# EAGLE design digibuttons (EAGLE 9.3.0)
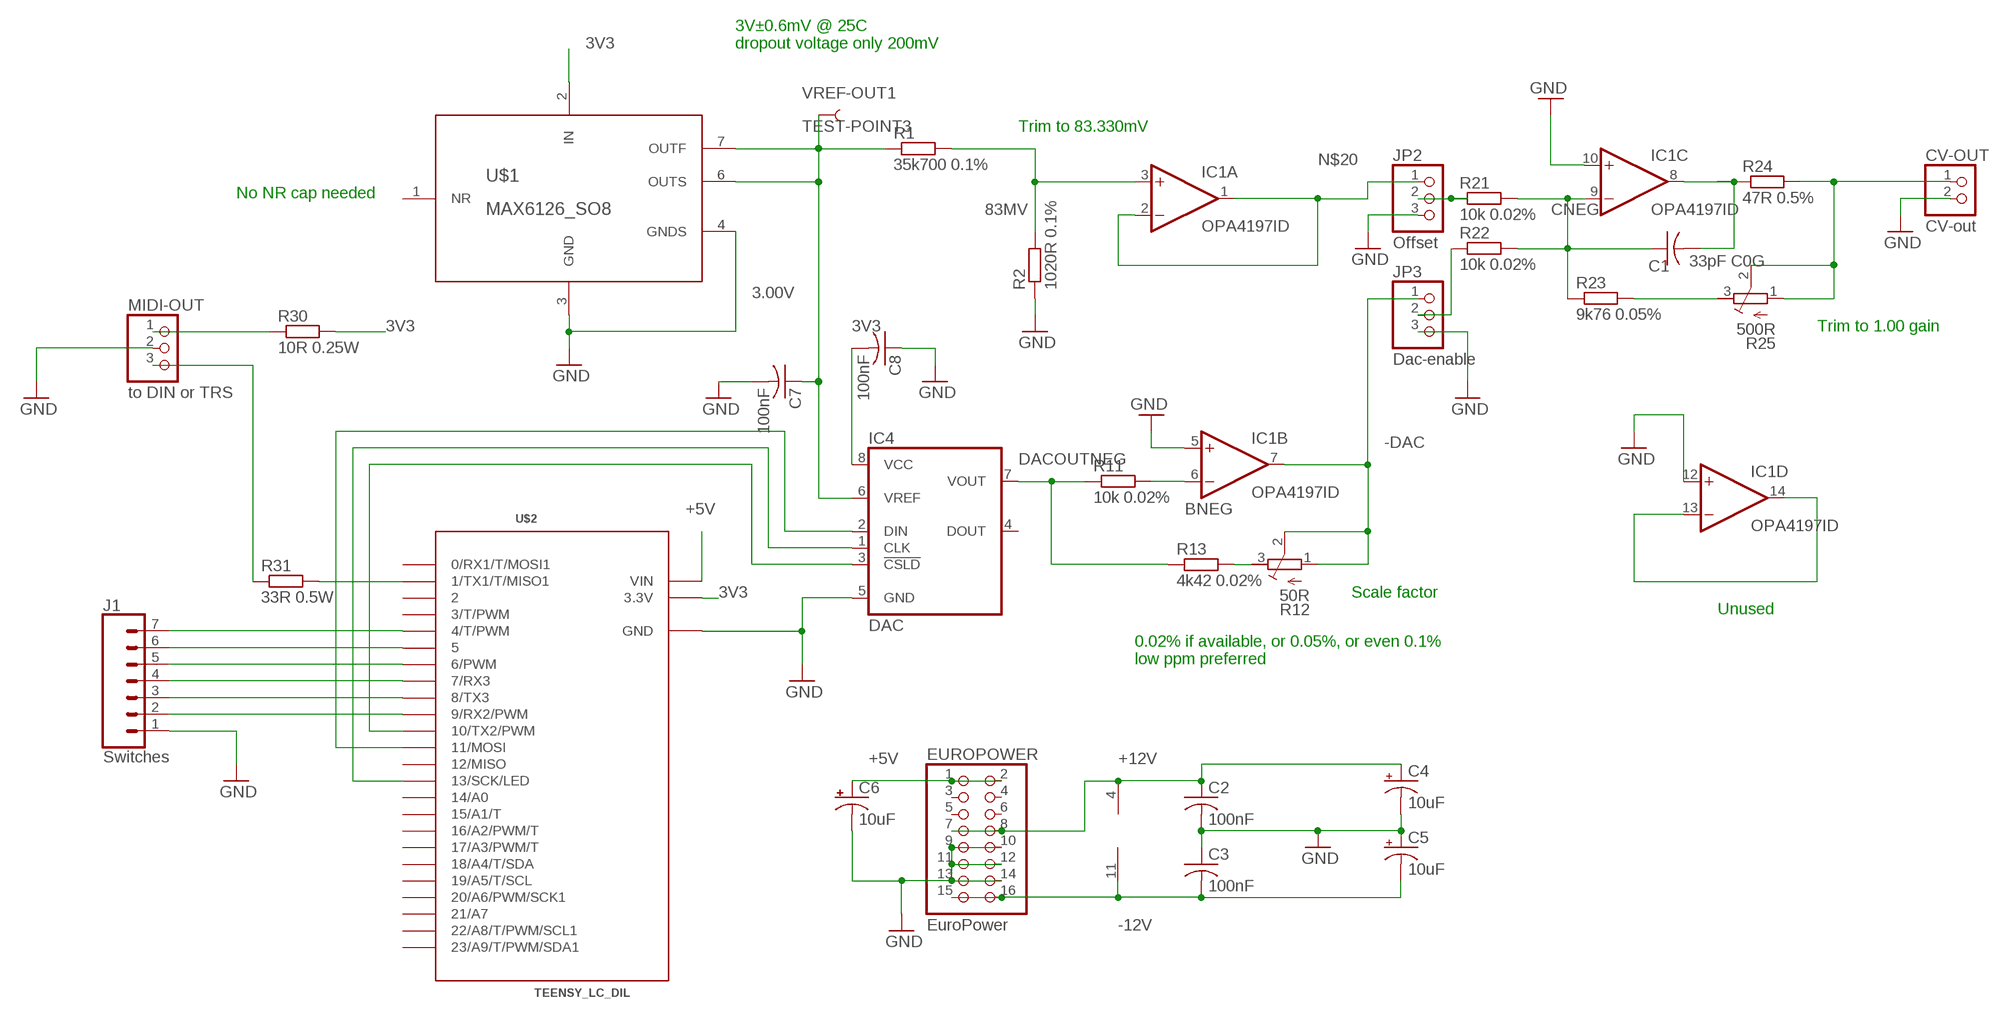
[diagram p0: schematic, sheet 1]

## Parts
C1  33pF C0G  C-USC0805  [C0805]
C2  100nF  C-USC1206  [C1206]
C3  100nF  C-USC1206  [C1206]
C4  10uF  10UF-POLAR-RADIAL-2.5MM-25V-20%  [CPOL-RADIAL-2.5MM-5MM]
C5  10uF  10UF-POLAR-RADIAL-2.5MM-25V-20%  [CPOL-RADIAL-2.5MM-5MM]
C6  10uF  10UF-POLAR-RADIAL-2.5MM-25V-20%  [CPOL-RADIAL-2.5MM-5MM]
C7  100nF  C-USC1206  [C1206]
C8  100nF  C-USC1206  [C1206]
CV-OUT  CV-out  PINHD-1X2  [1X02]
EUROPOWER  EuroPower  PINHD-2X8  [2X08]
IC1  OPA4197ID  OPA4743UA  [SO14]
IC4  DAC  LTC1658CS8SOIC8  [SOIC8_208MIL]
J1  Switches  CONN_07LOCK  [1X07_LOCK]
JP2  Offset  PINHD-1X3  [1X03]
JP3  Dac-enable  PINHD-1X3  [1X03]
MIDI-OUT  to DIN or TRS  PINHD-1X3  [1X03]
R1  35k700 0.1%  R-EU_R0805  [R0805]
R2  1020R 0.1%  R-EU_R0805  [R0805]
R11  10k 0.02%  R-EU_R0805  [R0805]
R12  50R  R-TRIMM3296W  [RTRIM3296W]
R13  4k42 0.02%  R-EU_R0805  [R0805]
R21  10k 0.02%  R-EU_R0805  [R0805]
R22  10k 0.02%  R-EU_R0805  [R0805]
R23  9k76 0.05%  R-EU_R0805  [R0805]
R24  47R 0.5%  R-EU_R0805  [R0805]
R25  500R  R-TRIMM3296W  [RTRIM3296W]
R30  10R 0.25W  RESISTOR10MM_RESISTOR  [10MM_RESISTOR]
R31  33R 0.5W  RESISTOR10MM_RESISTOR  [10MM_RESISTOR]
U$1  MAX6126_SO8  [SO08]
U$2  TEENSY_LC_DIL  [TEENSY_3.0-3.2&LC_DIL]
VREF-OUT1  TEST-POINT3  [PAD.03X.03]

## Nets
3.00V: C7.1 IC4.6(VREF) R1.1 U$1.6(OUTS) U$1.7(OUTF) VREF-OUT1.P$1
3V3: C8.2 IC4.8(VCC) R30.2 U$1.2(IN) U$2.3.3V
83MV: IC1.3(A:+IN) R1.2 R2.2
+5V: C6.1(+) EUROPOWER.1 EUROPOWER.2 U$2.VIN
+12V: C2.1 C4.1(+) EUROPOWER.7 EUROPOWER.8 IC1.4(P:V+)
-12V: C3.2 C5.2(-) EUROPOWER.15 EUROPOWER.16 IC1.11(P:V-)
-DAC: IC1.7(B:OUT) JP3.1 R12.1(E) R12.2(S)
BNEG: IC1.6(B:-IN) R11.2
CNEG: C1.1 IC1.9(C:-IN) R21.2 R22.2 R23.1
CS: IC4.3(!CSLD) U$2.10(10/TX2/PWM)
DACOUTNEG: IC4.7(VOUT) R11.1 R13.1
GND: C2.2 C3.1 C4.2(-) C5.1(+) C6.2(-) C7.2 C8.1 CV-OUT.2 EUROPOWER.9 EUROPOWER.10 EUROPOWER.11 EUROPOWER.12 EUROPOWER.13 EUROPOWER.14 IC1.5(B:+IN) IC1.10(C:+IN) IC1.12(D:+IN) IC4.5(GND) J1.1 JP2.3 JP3.3 MIDI-OUT.2 R2.1 U$1.3(GND) U$1.4(GNDS) U$2.AGND(GND) U$2.GND
MOSI: IC4.2(DIN) U$2.11(11/MOSI)
N$1: MIDI-OUT.1 R30.1
N$2: R31.2 U$2.1(1/TX1/T/MISO1)
N$3: IC1.13(D:-IN) IC1.14(D:OUT)
N$4: JP3.2 R22.1
N$5: MIDI-OUT.3 R31.1
N$6: JP2.2 R21.1
N$8: R23.2 R25.3(A)
N$9: C1.2 IC1.8(C:OUT) R24.1
N$10: CV-OUT.1 R24.2 R25.1(E) R25.2(S)
N$13: J1.2 U$2.9(9/RX2/PWM)
N$14: R12.3(A) R13.2
N$15: J1.3 U$2.8(8/TX3)
N$16: J1.4 U$2.7(7/RX3)
N$17: J1.5 U$2.6(6/PWM)
N$18: J1.6 U$2.5
N$19: J1.7 U$2.4(4/T/PWM)
N$20: IC1.1(A:OUT) IC1.2(A:-IN) JP2.1
SCLK: IC4.1(CLK) U$2.13(13/SCK/LED)
Unconnected: EUROPOWER.3 EUROPOWER.4 EUROPOWER.5 EUROPOWER.6 IC4.4(DOUT) U$1.1(NR) U$2.0(0/RX1/T/MOSI1) U$2.2 U$2.3(3/T/PWM) U$2.12(12/MISO) U$2.14/A0 U$2.15/A1(15/A1/T) U$2.16/A2(16/A2/PWM/T) U$2.17/A3(17/A3/PWM/T) U$2.18/A4(18/A4/T/SDA) U$2.19/A5(19/A5/T/SCL) U$2.20/A6(20/A6/PWM/SCK1) U$2.21/A7 U$2.22/A8(22/A8/T/PWM/SCL1) U$2.23/A9(23/A9/T/PWM/SDA1)

## Notes on the sheet
- 3V±0.6mV @ 25C
  dropout voltage only 200mV
- Trim to 83.330mV
- No NR cap needed
- Trim to 1.00 gain
- Scale factor
- Unused
- 0.02% if available, or 0.05%, or even 0.1%
  low ppm preferred

## Library data of the parts
C1-C3 C7 C8 = adafruit:C-US: CAPACITOR, American symbol
C4-C6 = SparkFun-Capacitors:10UF-POLAR: 10.0µF polarized capacitors A capacitor is a passive two-terminal electrical component used to store electrical energy temporarily in an electric field.; PROD_ID: CAP-08440
CV-OUT = pinhead:PINHD-1X2: PIN HEADER
EUROPOWER = pinhead:PINHD-2X8: PIN HEADER
IC1 = linear:OPA4743: 12V, 7MHz, CMOS, Rail-to-Rail I/O Quad OP AMP Source: http://focus.ti.com/lit/ds/sbos201/sbos201.pdf
IC4 = chris-dac-adc:LTC1658CS8: DIGITAL/ANALOG CONVERTER
J1 = SparkFun-Connectors:CONN_07: Multi connection point. Often used as Generic Header-pin footprint for 0.1 inch spaced/style header connections On any of the 0.1 inch spaced packages, you can populate with these: Break Away Headers - Straight <https://www.sparkfun.com/products/116> (PRT-00116) Break Away Male Headers - Right Angle <https://www.sparkfun.com/products/553> (PRT-00553) Female Headers <https://www.sparkfun.com/products/115> (PRT-00115) Break Away Headers - Machine Pin <https://www.sparkfun.com/products/117> (PRT-00117) Break Away Female Headers - Swiss Machine Pin <https://www.sparkfun.com/products/743> (PRT-00743) For SCREWTERMINALS and SPRING TERMINALS visit here: Screw Terimnals on SparkFun.com <https://www.sparkfun.com/search/results?term=Screw+Terminals> (5mm/3.5mm/2.54mm spacing) This device is also useful as a general connection point to wire up your design to another part of your project. Our various solder wires solder well into these plated through hole pads. Hook-Up Wire - Assortment (Stranded, 22 AWG) <https://www.sparkfun.com/products/11375> (PRT-11375) Hook-Up Wire - Assortment (Solid Core, 22 AWG) <https://www.sparkfun.com/products/11367> (PRT-11367) View the entire wire category on our website here <https://www.sparkfun.com/categories/141> Special notes: Molex polarized connector foot print use with SKU : PRT-08231 with associated crimp pins and housings. 1MM SMD Version SKU: PRT-10208 NOTES ON THE VARIANTS LOCK and LOCK_LONGPADS... This footprint was designed to help hold the alignment of a through-hole component (i.e. 6-pin header) while soldering it into place. You may notice that each hole has been shifted either up or down by 0.005 of an inch from it's more standard position (which is a perfectly straight line). This slight alteration caused the pins (the squares in the middle) to touch the edges of the holes. Because they are alternating, it causes a "brace" to hold the component in place. 0.005 has proven to be the perfect amount of "off-center" position when using our standard breakaway headers. Although looks a little odd when you look at the bare footprint, once you have a header in there, the alteration is very hard to notice. Also,if you push a header all the way into place, it is covered up entirely on the bottom side.
JP2 JP3 MIDI-OUT = adafruit:PINHD-1X3: PIN HEADER
R1 R2 R11 R13 R21-R24 = rcl:R-EU_: RESISTOR, European symbol; SPICEPREFIX: R
R12 R25 = resistor:R-TRIMM: Trimm resistor
R30 R31 = MusicThingModular:RESISTOR: Standard resistor, various versions
U$1 = max6126:MAX6126_SO8
U$2 = Teensy_3_and_LC_Series_Boards_v1.4:TEENSY_LC_DIL
VREF-OUT1 = SparkFun-Connectors:TEST-POINT: SparkFun Test Points Bare copper test points for troubleshooting or In-Circuit-Testing. These are used by our Production team for verifying production board runs using pogo-pins on test beds. SparkFun Products: SparkFun LSM9DS1 Breakout <https://www.sparkfun.com/products/13284> SparkFun PSOC <https://www.sparkfun.com/products/13714> SparkFun Load Cell Amplifier <https://www.sparkfun.com/products/13879>

## Board
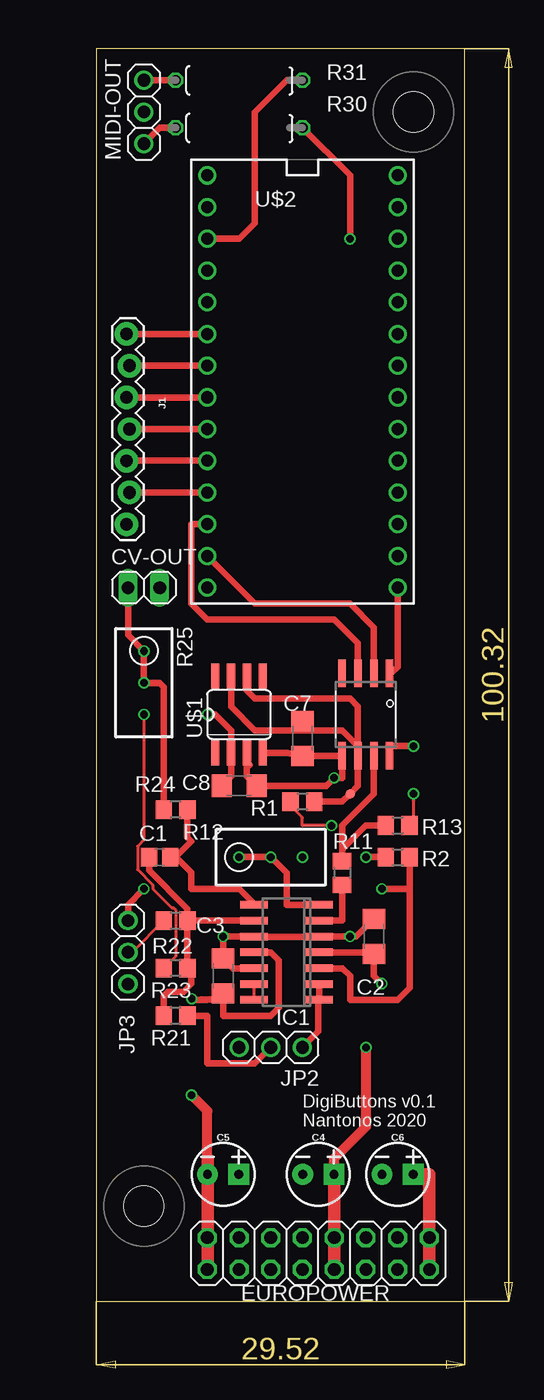
[diagram p1: board, top side]
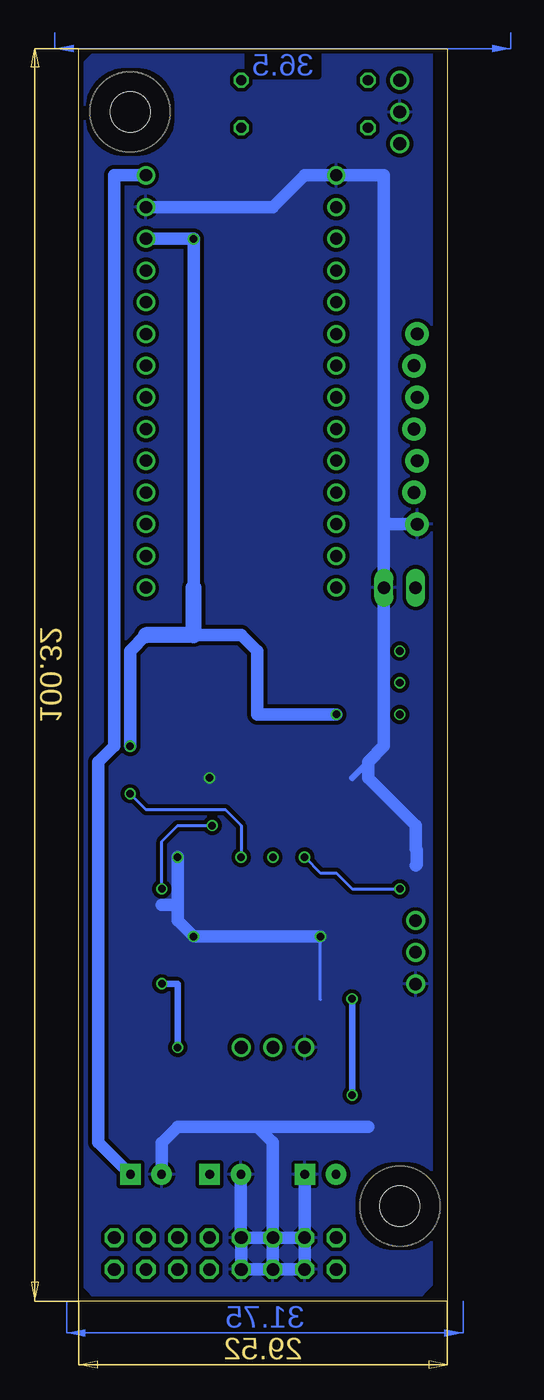
[diagram p2: board, bottom side, seen from below]

Size 29.52 x 100.32 mm. Coordinates in mm from the lower left corner, seen from the top.
Outline: 0,0 29.52,0 29.52,100.32 0,100.32 0,0
Copper layers (1*16): Top 0.035559375mm / dielectric 1.6mm / Bottom 0.035559375mm
Design rules "oshpark-2layer": minimum track width 6mil, minimum drill 10mil, track to track 6mil, track to pad 6mil, pad to pad 6mil, via to via 6mil, smd to smd 6mil, copper to edge 15mil, drill to drill 6mil, minimum pad ring 5mil, minimum via ring 5mil, stop-mask expansion 2.5mil, vias tented up to drill 0mil, thermal gap 10mil

### Footprints (pad centres in the part's own frame; a part is rotated, then mirrored left to right if it is on the bottom)
C0805 = smd 1.3 x 1.5: 1 -0.85,0; 2 0.85,0
C1206 = smd 1.6 x 1.8: 1 -1.4,0; 2 1.4,0
CPOL-RADIAL-2.5MM-5MM = drill 0.7 pad 1.651 square: 1 1.25,0 | drill 0.7 pad 1.651: 2 -1.25,0
1X02 = drill 1.016 long: 1 -1.27,0; 2 1.27,0
2X08 = drill 1.016 octagon: 1 -8.89,-1.27; 2 -8.89,1.27; 3 -6.35,-1.27; 4 -6.35,1.27; 5 -3.81,-1.27; 6 -3.81,1.27; 7 -1.27,-1.27; 8 -1.27,1.27; 9 1.27,-1.27; 10 1.27,1.27; 11 3.81,-1.27; 12 3.81,1.27; 13 6.35,-1.27; 14 6.35,1.27; 15 8.89,-1.27; 16 8.89,1.27
SO14 = smd 0.6 x 2.2: 1 -3.81,-2.6; 2 -2.54,-2.6; 3 -1.27,-2.6; 4 0,-2.6; 5 1.27,-2.6; 6 2.54,-2.6; 7 3.81,-2.6; 8 3.81,2.6; 9 2.54,2.6; 10 1.27,2.6; 11 0,2.6; 12 -1.27,2.6; 13 -2.54,2.6; 14 -3.81,2.6
SOIC8_208MIL = smd 0.6 x 2.2: 1 -1.905,-3.315; 2 -0.635,-3.315; 3 0.635,-3.315; 4 1.905,-3.315; 5 1.905,3.315; 6 0.635,3.315; 7 -0.635,3.315; 8 -1.905,3.315
1X07_LOCK = drill 1.016 pad 1.88: 1 0,0.127; 2 2.54,-0.127; 3 5.08,0.127; 4 7.62,-0.127; 5 10.16,0.127; 6 12.7,-0.127; 7 15.24,0.127
1X03 = drill 1.016: 1 -2.54,0; 2 0,0; 3 2.54,0
R0805 = smd 1.3 x 1.5: 1 -0.95,0; 2 0.95,0
RTRIM3296W = drill 0.61: 1 0,-2.54; 2 0,0; 3 0,2.54
10MM_RESISTOR = drill 0.813 octagon: 1 -5.08,0; 2 5.08,0
SO08 = smd 0.66 x 2.032: 1 -1.905,-3.073; 2 -0.635,-3.073; 3 0.635,-3.073; 4 1.905,-3.073; 5 1.905,3.073; 6 0.635,3.073; 7 -0.635,3.073; 8 -1.905,3.073
TEENSY_3.0-3.2&LC_DIL = drill 0.965: 0 -7.62,13.97; 1 -7.62,11.43; 2 -7.62,8.89; 3 -7.62,6.35; 3.3V 7.62,11.43; 4 -7.62,3.81; 5 -7.62,1.27; 6 -7.62,-1.27; 7 -7.62,-3.81; 8 -7.62,-6.35; 9 -7.62,-8.89; 10 -7.62,-11.43; 11 -7.62,-13.97; 12 -7.62,-16.51; 13 7.62,-16.51; 14/A0 7.62,-13.97; 15/A1 7.62,-11.43; 16/A2 7.62,-8.89; 17/A3 7.62,-6.35; 18/A4 7.62,-3.81; 19/A5 7.62,-1.27; 20/A6 7.62,1.27; 21/A7 7.62,3.81; 22/A8 7.62,6.35; 23/A9 7.62,8.89; AGND 7.62,13.97; GND -7.62,16.51; VIN 7.62,16.51
MOUNTING_HOLE = hole 3.2: 0,0
PAD.03X.03 = smd 0.762 x 0.762: P$1 0,0

### Placement (x,y rotation side)
C1  5.08,35.56 0 top
C2  22.22,29.21 90 top
C3  10.16,26.04 270 top
C4  17.78,10.16 0 top
C5  10.16,10.16 0 top
C6  24.13,10.16 0 top
C7  16.51,45.09 270 top
C8  11.43,41.27 180 top
CV-OUT  3.81,57.15 0 top
EUROPOWER  17.78,3.81 180 top
IC1  15.24,27.94 90 top
IC4  21.59,46.99 180 top
J1  2.54,62.23 90 top
JP2  13.97,20.32 180 top
JP3  2.54,27.94 270 top
MIDI-OUT  3.81,95.25 90 top
R1  16.51,40.01 180 top
R2  24.13,35.56 0 top
R11  19.69,34.29 270 top
R12  13.97,35.56 270 top
R13  24.13,38.1 0 top
R21  6.35,22.86 180 top
R22  6.35,30.48 0 top
R23  6.35,26.67 180 top
R24  6.35,39.37 180 top
R25  3.81,49.53 180 top
R30  11.43,93.98 0 top
R31  11.43,97.79 0 top
U$1  11.43,46.99 0 top
U$2  16.51,73.66 0 top
U$3  MOUNTING_HOLE  [MOUNTING_HOLE]  25.4,95.25 0 top
U$4  MOUNTING_HOLE  [MOUNTING_HOLE]  3.81,7.62 0 top
VREF-OUT1  20.32,40.64 0 top

### Tracks (layer width: path | path; a pad name or v marks a point on that pad's centre or on a via)
3.00V
  Top 0.254: C7.1 16.51,45.72
  Top 0.508: U$1.6 12.06,48.89 12.7,48.26 20.32,48.26 20.95,47.62 20.95,44.45 | 20.95,44.45 20.44,44.96 19.69,45.72 16.51,45.72 12.7,45.72 10.8,47.62 U$1.7 | R1.1 19.69,40.01 VREF-OUT1.P$1 20.95,41.27 IC4.6 20.95,44.45
3V3  (via drill 0.6)
  Top 0.508: v8.89,46.99 9.52,46.99 10.8,45.72 U$1.2 10.8,42.04 C8.2 | IC4.8 23.49,44.45 v25.4,44.45 | R30.2 20.32,90.17 v20.32,85.09
  Bottom 1.016: 20.32,53.34 16.51,53.34 15.24,52.07 15.24,46.99 v8.89,46.99 | 24.13,53.34 25.4,52.07 v25.4,44.45 | 20.32,57.15 v20.32,85.09 U$2.3.3V
  Bottom 1.27: 20.32,57.15 20.32,53.34 24.13,53.34
83MV  (via drill 0.6)
  Top 0.254: R1.2 15.24,40.01 16.51,38.73 16.51,38.1 v18.83,38.1
  Top 0.508: R2.2 25.08,33.02 | 25.08,33.02 25.08,25.08 24.13,24.13 20.32,24.13 20.32,26.04 19.69,26.67 IC1.3 | v22.86,33.02 25.08,33.02
  Bottom 0.254: v22.86,33.02 22.86,36.83 21.59,38.1 v18.83,38.1
+5V
  Top 1.016: EUROPOWER.2 EUROPOWER.1 26.67,10.16 C6.1
  Bottom 1.016: C6.1 27.94,12.72 27.94,43.18 26.67,44.45 26.67,90.17 U$2.VIN
+12V  (via drill 0.6)
  Top 0.508: v22.86,25.42 22.22,26.06 C2.1 22.09,27.94 IC1.4
  Top 0.813: v21.59,20.32 21.59,13.97 19.03,11.41 C4.1
  Top 1.016: EUROPOWER.8 EUROPOWER.7 19.05,10.14 C4.1
  Bottom 0.508: v21.59,20.32 21.59,25.4 22.86,25.4 v22.86,25.42
-12V  (via drill 0.6)
  Top 0.508: IC1.11 13.97,27.94 14.6,27.3 14.6,23.5 13.97,22.86 10.16,22.86 C3.2 9.71,24.19 8.89,24.19 | 8.41,24.19 8.89,24.19 | 8.89,24.19 8.83,24.13 7.62,24.13 7.64,24.15 v7.64,24.21
  Top 0.813: 8.91,11.41 8.89,11.43 8.89,15.24 v7.62,16.51
  Top 1.016: 8.91,5.1 EUROPOWER.15 | EUROPOWER.16 8.91,2.56 8.91,5.1 | 8.91,11.41 C5.2 8.91,5.1
  Bottom 0.508: 7.68,24.19 7.64,24.15 | v7.62,16.51 7.62,24.13 7.64,24.15 | v7.64,24.21 7.64,24.15
-DAC  (via drill 0.6)
  Top 0.254: 17.78,31.75 IC1.7
  Top 0.508: v3.81,33.02 2.54,31.75 JP3.1 | 17.78,31.75 15.24,31.75 15.24,34.29 R12.2 R12.1
  Bottom 0.254: v3.81,33.02 7.62,33.02 8.89,34.29 10.16,34.29 R12.1
BNEG
  Top 0.254: IC1.6 19.05,30.48
  Top 0.508: R11.2 19.69,30.48 19.05,30.48
CNEG
  Top 0.254: 7.62,30.48 R22.2
  Top 0.508: IC1.9 7.62,30.48 | R21.2 5.4,24.45 5.71,24.77 6.98,24.77 7.62,25.4 7.62,26.35 R23.1 R22.2 7.3,31.44 4.23,34.51 C1.1
CS
  Top 0.508: IC4.3 20.95,52.7 19.05,54.61 8.89,54.61 7.62,55.88 7.62,62.23 U$2.10
DACOUTNEG
  Top 0.508: IC4.7 22.22,40.64 19.69,38.1 19.69,36.2 | R13.1 21.59,38.1 19.69,36.2 | 19.69,36.2 R11.1
GND  (via drill 0.6)
  Top 0.254: 12.67,29.18 IC1.10
  Top 0.508: U$1.4 15.31,43.92 C7.2 IC4.5 19.69,41.91 v19.05,41.91 18.41,41.27 C8.1 12.06,42.04 U$1.3 12.06,43.18 12.28,42.97 | IC1.10 v10.16,29.21 C3.1 10.92,26.67 IC1.12 | 12.67,29.18 17.81,29.18 IC1.5 v20.32,29.21 20.82,29.21 C2.2 | R2.1 v21.59,35.56
  Bottom 0.254: 10.16,24.13 v10.16,29.21
  Bottom 0.508: 7.62,41.91 6.35,43.18
  Bottom 1.016: EUROPOWER.13 EUROPOWER.11 | EUROPOWER.11 EUROPOWER.9 | EUROPOWER.12 EUROPOWER.14 EUROPOWER.13 | EUROPOWER.12 EUROPOWER.10 EUROPOWER.9 | EUROPOWER.11 EUROPOWER.12 | C5.1 11.43,10.14 EUROPOWER.13 | C4.2 16.53,5.1 EUROPOWER.9 | C6.2 22.88,12.68 21.59,13.97 15.24,13.97 | 15.24,13.97 13.97,12.7 EUROPOWER.11 | 15.24,13.97 6.35,13.97 | 22.86,31.75 21.59,31.75 | 21.59,31.75 v21.59,35.56 | 21.59,31.75 21.59,30.48 v20.32,29.21 v10.16,29.21 | U$2.AGND 13.97,87.63 11.43,90.17 U$2.GND 5.08,90.17 5.08,62.23 | 5.08,62.23 5.08,44.45 6.35,43.18 6.35,41.91 2.54,38.1 2.54,36.23 2.44,36.13 2.44,34.99 2.54,34.89 | J1.1 5.08,62.23
  pour Bottom (isolate 0.305): 1.27,99.06 1.27,1.27 2.54,0 27.94,0 29.21,1.27 29.21,99.06 27.94,100.33 26.67,100.33 1.27,100.33
MOSI
  Top 0.508: IC4.2 22.22,53.98 20.32,55.88 12.7,55.88 U$2.11
N$1
  Top 0.508: MIDI-OUT.1 5.08,93.98 R30.1
N$2
  Top 0.508: R31.2 15.24,97.79 12.7,95.25 12.7,86.36 11.43,85.09 U$2.1
N$3
  Top 0.254: IC1.14 IC1.13
N$4
  Top 0.254: R22.1 2.86,27.94 JP3.2
N$5
  Top 0.508: MIDI-OUT.3 R31.1
N$6
  Top 0.508: R21.1 8.89,22.86 8.89,19.05 12.7,19.05 JP2.2
N$8
  Top 0.254: R25.3 3.81,36.94 3.3,36.43 3.3,34.56 4.54,33.32 4.54,33.02 6.05,31.51 6.17,31.51 6.35,31.33 6.35,27.62 R23.2
N$9
  Top 0.254: C1.2 6.21,35.76
  Top 0.508: IC1.8 12.64,31.81 11.43,33.02 7.62,33.02 7.62,34.35 6.21,35.76 | C1.2 6.35,35.56 7.62,36.83 7.3,37.15 R24.1
N$10
  Top 0.508: CV-OUT.1 2.54,53.34 R25.1 R25.2 5.08,49.53 5.4,49.21 R24.2
N$13
  Top 0.508: U$2.9 J1.2
N$14  (via drill 0.6)
  Top 0.254: R13.2 25.4,38.42 v25.4,40.64
  Bottom 0.254: v25.4,40.64 24.13,39.37 17.78,39.37 16.51,38.1 R12.3
N$15
  Top 0.508: U$2.8 J1.3
N$16
  Top 0.508: U$2.7 J1.4
N$17
  Top 0.508: U$2.6 J1.5
N$18
  Top 0.508: U$2.5 J1.6
N$19
  Top 0.254: 2.54,77.47 J1.7
  Top 0.508: U$2.4 2.54,77.47
N$20
  Top 0.508: IC1.2 IC1.1 17.78,24.07 17.78,21.59 JP2.1
SCLK
  Top 0.254: 23.63,50.3 IC4.1
  Top 0.508: U$2.13 24.13,50.8 23.63,50.3
(copper drawn outside any net)
  shapes: Bottom area x2

### Text on the board
Document: Red stripe / -12V
tSilk: DigiButtons v0.1 / Nantonos 2020